# Altium schematic sheet 28_Pins.SchDoc (part 1 of 4)
size A2; SheetNumber: 1; SheetTotal: 1
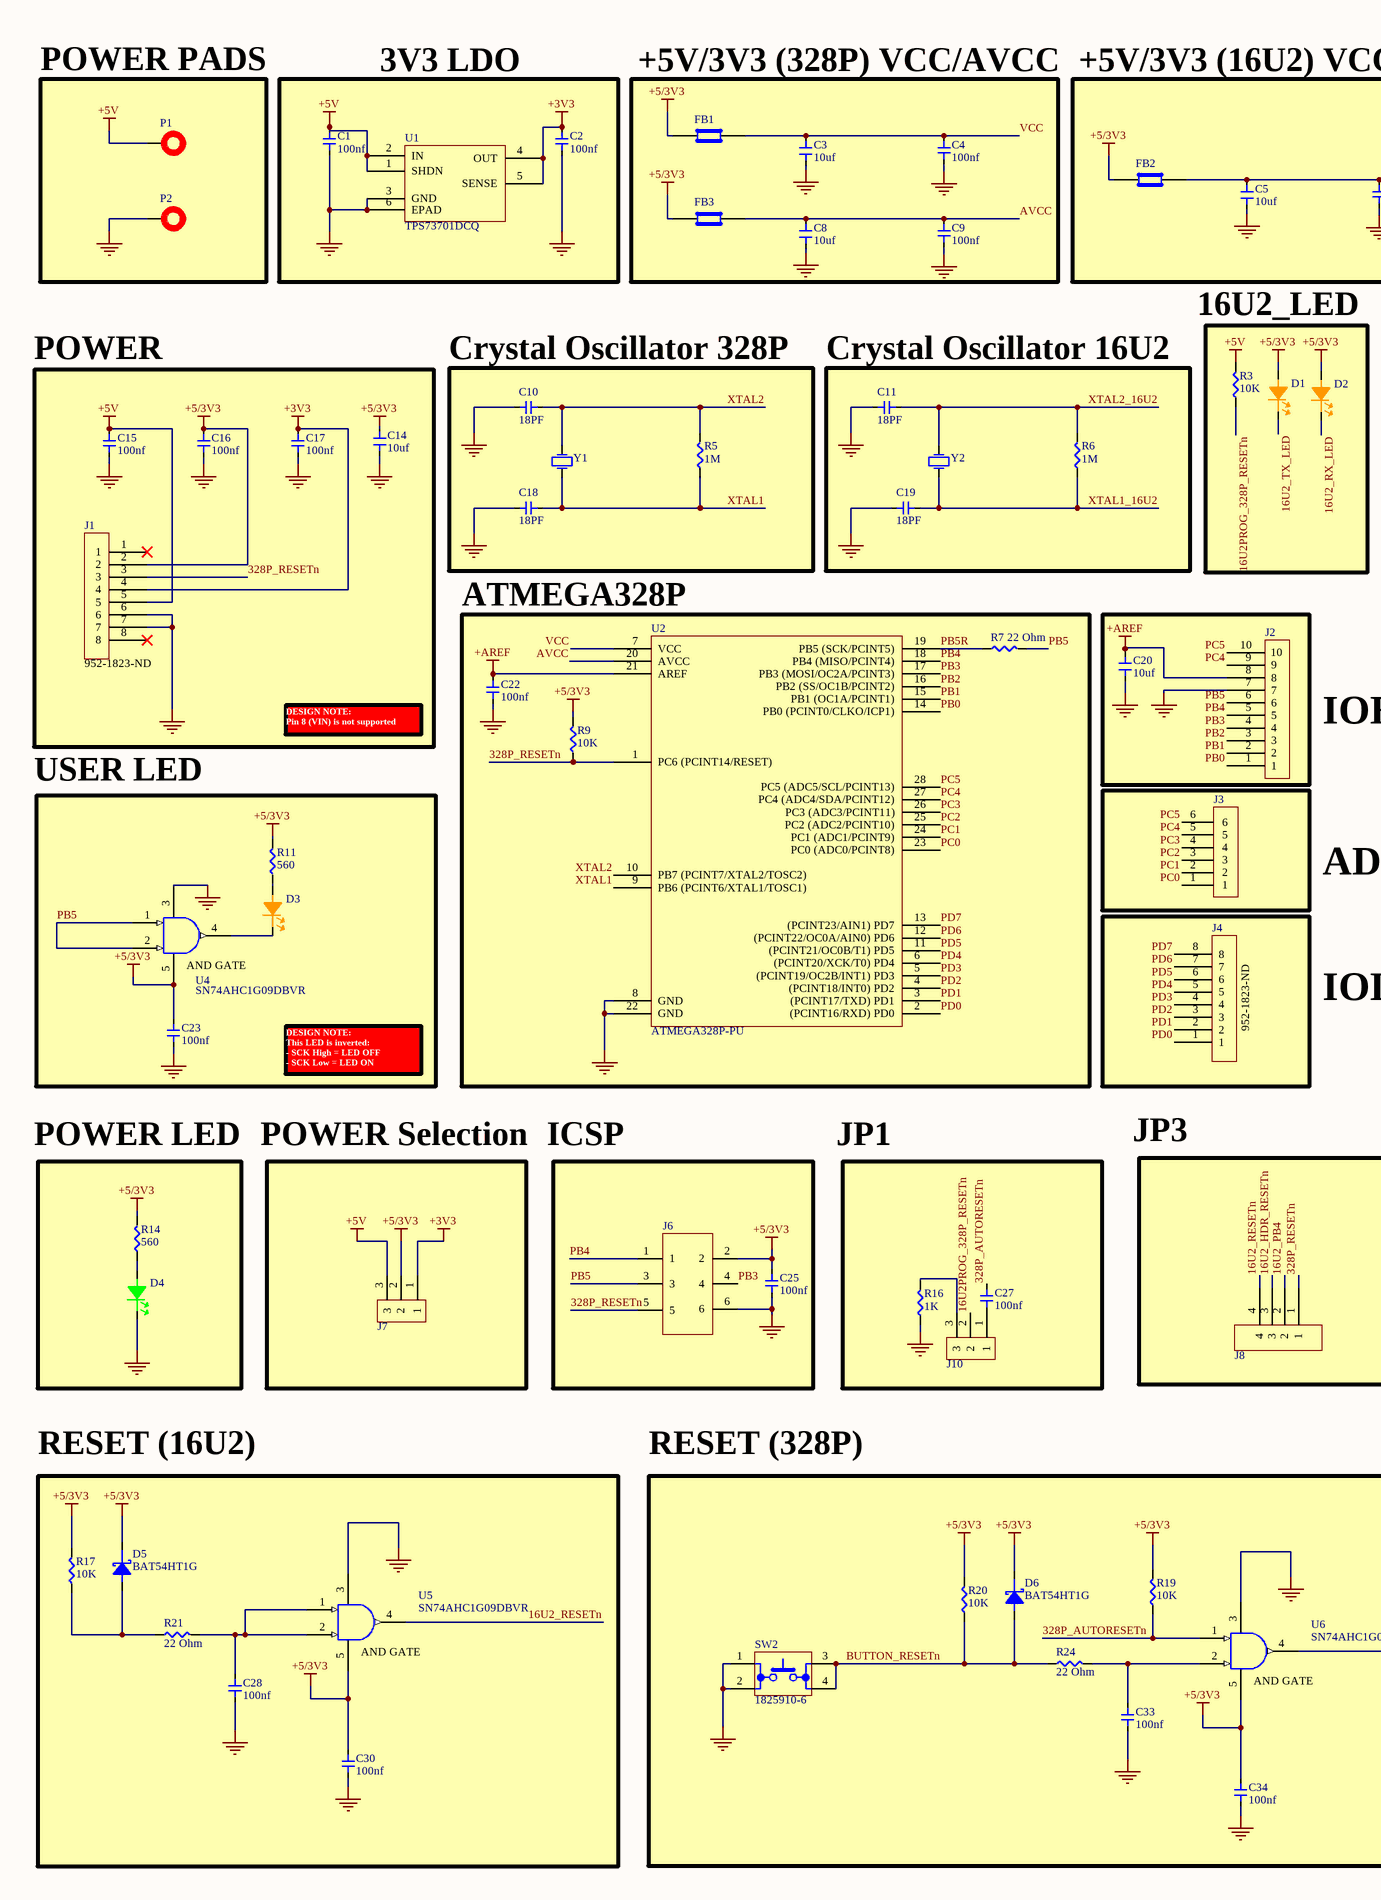
[diagram p0: 28_Pins.SchDoc, left]
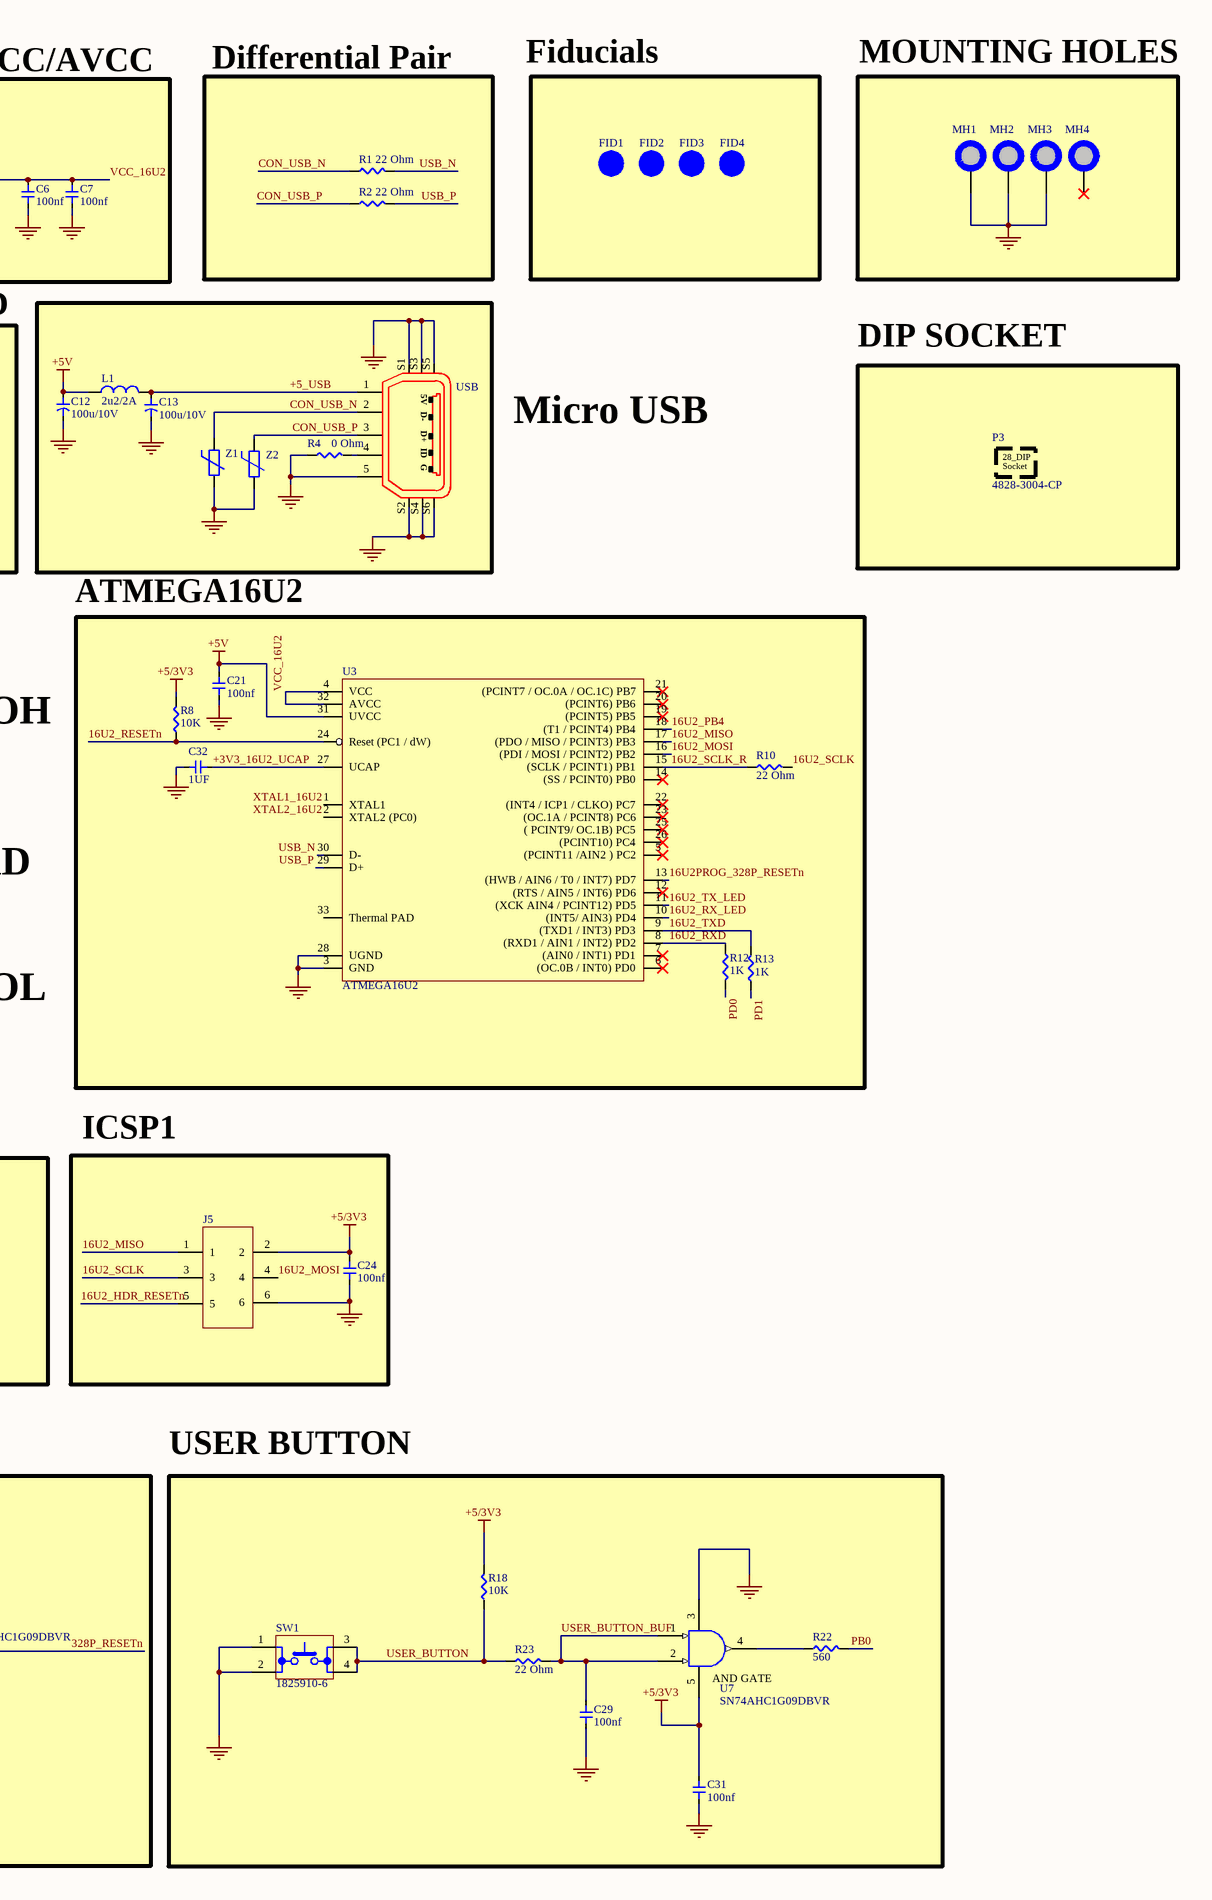
[diagram p1: 28_Pins.SchDoc, right]

## Parts
C1  100nf  [Cap_100nf]
C2  100nf  [Cap_100nf]
C3  10uf  [Cap_10uf]
C4  100nf  [Cap_100nf]
C5  10uf  [Cap_10uf]
C6  100nf  [Cap_100nf]
C7  100nf  [Cap_100nf]
C8  10uf  [Cap_10uf]
C9  100nf  [Cap_100nf]
C10  18PF  [Cap_100nf]
C11  18PF  [Cap_100nf]
C12  100u/10V  [Capacitor100uf]
C13  100u/10V  [Capacitor100uf]
C14  10uf  [Cap_10uf]
C15  100nf  [Cap_100nf]
C16  100nf  [Cap_100nf]
C17  100nf  [Cap_100nf]
C18  18PF  [Cap_100nf]
C19  18PF  [Cap_100nf]
C20  10uf  [Cap_10uf]
C21  100nf  [Cap_100nf]
C22  100nf  [Cap_100nf]
C23  100nf  [Cap_100nf]
C24  100nf  [Cap_100nf]
C25  100nf  [Cap_100nf]
C27  100nf  [Cap_100nf]
C28  100nf  [Cap_100nf]
C29  100nf  [Cap_100nf]
C30  100nf  [Cap_100nf]
C31  100nf  [Cap_100nf]
C32  1UF  [Cap_10uf]
C33  100nf  [Cap_100nf]
C34  100nf  [Cap_100nf]
D1  LO L29K-H2K1-24-0-2-R18-Z  [LED Indication]  (value not drawn)
D2  LO L29K-H2K1-24-0-2-R18-Z  [LED Indication]  (value not drawn)
D3  LO L29K-H2K1-24-0-2-R18-Z  [LED Indication]  (value not drawn)
D4  LG L29K-G2J1-24-0-2-R18-Z  [LED Indication]  (value not drawn)
D5  BAT54HT1G  [diode]
D6  BAT54HT1G  [diode]
FB1  MPZ2012S601AT000  [Cap_10uf]  (value not drawn)
FB2  MPZ2012S601AT000  [Cap_10uf]  (value not drawn)
FB3  MPZ2012S601AT000  [Cap_10uf]  (value not drawn)
FID1  Fid_1MMC  [FID]  (value not drawn)  (no BOM)
FID2  Fid_1MMC  [FID]  (value not drawn)  (no BOM)
FID3  Fid_1MMC  [FID]  (value not drawn)  (no BOM)
FID4  Fid_1MMC  [FID]  (value not drawn)  (no BOM)
J1  Supplier Part Number 1: 952-1823-ND  [header_8pins]  (hidden comment: M20-7820842)
J2  M20-7821046  [female header]  (value not drawn)
J3  M20-7820646  [header_6pins]  (value not drawn)
J4  Supplier Part Number 1: 952-1823-ND  [header_8pins]  (hidden comment: M20-7820842)
J5  67997-106HLF  [header_6pins]  (value not drawn)
J6  67997-106HLF  [header_6pins]  (value not drawn)
J7  68000-103HLF  [header_3pins]  (value not drawn)
J8  68001-204HLF  [header_4pins]  (value not drawn)
J10  68000-103HLF  [header_3pins]  (value not drawn)
L1  2u2/2A  [inductor]
MH1  Mounting Holes  [MH]  (value not drawn)  (no BOM)
MH2  Mounting Holes  [MH]  (value not drawn)  (no BOM)
MH3  Mounting Holes  [MH]  (value not drawn)  (no BOM)
MH4  Mounting Holes  [MH]  (value not drawn)  (no BOM)
P1  pad  [MH]  (value not drawn)
P2  pad  [MH]  (value not drawn)
P3  4828-3004-CP  [dip_socket]
R1  22 Ohm  [Resistor_1M]
R2  22 Ohm  [Resistor_1M]
R3  10K  [Resistor_1M]
R4  0 Ohm  [Resistor_1M]
R5  1M  [Resistor_1M]
R6  1M  [Resistor_1M]
R7  22 Ohm  [Resistor_1M]
R8  10K  [Resistor_1M]
R9  10K  [Resistor_1M]
R10  22 Ohm  [Resistor_1M]
R11  560  [Resistor_1M]
R12  1K  [Resistor_1M]
R13  1K  [Resistor_1M]
R14  560  [Resistor_1M]
R16  1K  [Resistor_1M]
R17  10K  [Resistor_1M]
R18  10K  [Resistor_1M]
R19  10K  [Resistor_1M]
R20  10K  [Resistor_1M]
R21  22 Ohm  [Resistor_1M]
R22  560  [Resistor_1M]
R23  22 Ohm  [Resistor_1M]
R24  22 Ohm  [Resistor_1M]
SW1  1825910-6  [Switch]
SW2  1825910-6  [Switch]
U1  TPS73701DCQ  [LDO]
U2  ATMEGA328P-PU  [DIP28]
U3  ATMEGA16U2  [ATMEGA16U2]
U4  SN74AHC1G09DBVR  [AND]
U5  SN74AHC1G09DBVR  [AND]
U6  SN74AHC1G09DBVR  [AND]
U7  SN74AHC1G09DBVR  [AND]
USB  10118193-0001LF  [AMPHENOL_10118193-0001LF]  (value not drawn)
Y1  ABM7-16.000MHZ-D2Y-T  [crystal]  (value not drawn)
Y2  ABM7-16.000MHZ-D2Y-T  [crystal]  (value not drawn)
Z1  CG0603MLC-05E  [varistor]  (value not drawn)
Z2  CG0603MLC-05E  [varistor]  (value not drawn)

## Blocks framed on the sheet
POWER PADS: P1 P2
3V3 LDO: C1 C2 U1
+5V/3V3 (328P) VCC/AVCC: C3 C4 C8 C9 FB1 FB3
+5V/3V3 (16U2) VCC/AVCC: C5-C7 FB2
Differential Pair: R1 R2
MOUNTING HOLES: MH1-MH4
POWER: C14-C17 J1
Crystal Oscillator 328P: C10 C18 R5 Y1
Crystal Oscillator 16U2: C11 C19 R6 Y2
DIP SOCKET: P3
ATMEGA328P: C22 R7 R9 U2
ATMEGA16U2: C21 C32 R8 R10 R12 R13 U3
USER LED: C23 D3 R11 U4
ICSP1: C24 J5
RESET (16U2): C28 C30 D5 R17 R21 U5
RESET (328P): C33 C34 D6 R19 R20 R24 SW2 U6
USER BUTTON: C29 C31 R18 R22 R23 SW1 U7

## Nets
+3V3: C2.2 C17.2 J1.4 J7.1 U1.4(OUT) U1.5(SENSE)
+5/3V3: C14.1 C16.2 C23.2 C24.2 C25.2 C30.2 C31.2 C34.2 D1.2(anode) D2.2(anode) D5.1(cathode) D6.1(cathode) FB1.1 FB2.1 FB3.1 J1.2 J5.2 J6.2 J7.2 R8.2 R9.2 R11.2 R14.2 R17.2 R18.2 R19.2 R20.2 U4.5 U5.5 U6.5 U7.5
+5V: C1.2 C12.1(+) C15.2 C21.2 J1.5 J7.3 L1.14 P1.1 R3.2 U1.1(SHDN) U1.2(IN) U3.31(UVCC)
+AREF: C20.1 C22.2 J2.8 U2.21(AREF)
GND: C1.1 C2.1 C3.2 C4.1 C5.2 C6.1 C7.1 C8.2 C9.1 C10.2 C11.2 C12.2 C13.2 C14.2 C15.1 C16.1 C17.1 C18.2 C19.2 C20.2 C21.1 C22.1 C23.1 C24.1 C25.1 C28.2 C29.2 C30.1 C31.1 C32.2 C33.2 C34.1 D4.1(cathode) J1.6 J1.7 J2.7 J5.6 J6.6 MH1.1 MH2.1 MH3.1 P2.1 R4.1 R16.1 SW1.1 SW1.2 SW2.1 SW2.2 U1.3(GND) U1.6(EPAD) U2.8(GND) U2.22(GND) U3.3(GND) U3.28(UGND) U4.3 U5.3 U6.3 U7.3 USB.5 USB.S1 USB.S2 USB.S3 USB.S4 USB.S5 USB.S6 Z1.12 Z2.12
16U2_HDR_RESETn: J5.5 J8.3
16U2_MISO: J5.1 U3.17((PDO_/_MISO_/_PCINT3)_PB3)
16U2_MOSI: J5.4 U3.16((PDI_/_MOSI_/_PCINT2)_PB2)
16U2_PB4: J8.2 U3.18((T1_/_PCINT4)_PB4)
16U2_RESETn: J8.4 R8.1 U3.24(Reset_(PC1_/_dW)) U5.4
16U2_RX_LED: D2.1(cathode) U3.10((INT5/_AIN3)_PD4)
16U2_RXD: R12.1 U3.8((RXD1_/_AIN1_/_INT2)_PD2)
16U2_SCLK: J5.3 R10.2
16U2_SCLK_R: R10.1 U3.15((SCLK_/_PCINT1)_PB1)
16U2_TX_LED: D1.1(cathode) U3.11((XCK_AIN4_/_PCINT12)_PD5)
16U2_TXD: R13.2 U3.9((TXD1_/_INT3)_PD3)
16U2PROG_328P_RESETn: J10.2 R3.1 U3.13((HWB_/_AIN6_/_T0_/_INT7)_PD7)
328P_AUTORESETn: C27.2 R19.1 U6.1
328P_RESETn: J1.3 J6.5 J8.1 R9.1 U2.1(PC6_(PCINT14/RESET)) U6.4
+3V3_16U2_UCAP: C32.1 U3.27(UCAP)
+5_USB: C13.1(+) L1.15 USB.1
AVCC: C8.1 C9.2 FB3.2 U2.20(AVCC)
BUTTON_RESETn: D6.2(anode) R20.1 R24.1 SW2.3 SW2.4
CON_USB_N: R1.1 USB.2 Z1.13
CON_USB_P: R2.1 USB.3 Z2.13
PB0: J2.1 R22.2 U2.14(PB0_(PCINT0/CLKO/ICP1))
PB1: J2.2 U2.15(PB1_(OC1A/PCINT1))
PB2: J2.3 U2.16(PB2_(SS/OC1B/PCINT2))
PB3: J2.4 J6.4 U2.17(PB3_(MOSI/OC2A/PCINT3))
PB4: J2.5 J6.1 U2.18(PB4_(MISO/PCINT4))
PB5: J2.6 J6.3 R7.2 U4.1 U4.2
PB5R: R7.1 U2.19(PB5_(SCK/PCINT5))
PC0: J3.1 U2.23(PC0_(ADC0/PCINT8))
PC1: J3.2 U2.24(PC1_(ADC1/PCINT9))
PC2: J3.3 U2.25(PC2_(ADC2/PCINT10))
PC3: J3.4 U2.26(PC3_(ADC3/PCINT11))
PC4: J2.9 J3.5 U2.27(PC4_(ADC4/SDA/PCINT12))
PC5: J2.10 J3.6 U2.28(PC5_(ADC5/SCL/PCINT13))
PD0: J4.1 R12.2 U2.2((PCINT16/RXD)_PD0)
PD1: J4.2 R13.1 U2.3((PCINT17/TXD)_PD1)
PD2: J4.3 U2.4((PCINT18/INT0)_PD2)
PD3: J4.4 U2.5((PCINT19/OC2B/INT1)_PD3)
PD4: J4.5 U2.6((PCINT20/XCK/T0)_PD4)
PD5: J4.6 U2.11((PCINT21/OC0B/T1)_PD5)
PD6: J4.7 U2.12((PCINT22/OC0A/AIN0)_PD6)
PD7: J4.8 U2.13((PCINT23/AIN1)_PD7)
USB_N: R1.2 U3.30(D-)
USB_P: R2.2 U3.29(D+)
USER_BUTTON: R18.1 R23.1 SW1.3 SW1.4
USER_BUTTON_BUF: C29.1 R23.2 U7.1 U7.2
VCC: C3.1 C4.2 FB1.2 U2.7(VCC)
VCC_16U2: C5.1 C6.2 C7.2 FB2.2 U3.4(VCC) U3.32(AVCC)
XTAL1: C18.1 R5.1 U2.9(PB6_(PCINT6/XTAL1/TOSC1)) Y1.1
XTAL1_16U2: C19.1 R6.1 U3.1(XTAL1) Y2.1
XTAL2: C10.1 R5.2 U2.10(PB7_(PCINT7/XTAL2/TOSC2)) Y1.2
XTAL2_16U2: C11.1 R6.2 U3.2(XTAL2_(PC0)) Y2.2
NetC27_1: C27.1 J10.1
NetC28_1: C28.1 R21.2 U5.1 U5.2
NetC33_1: C33.1 R24.2 U6.2
NetD3_1: D3.1(cathode) U4.4
NetD3_2: D3.2(anode) R11.1
NetD4_2: D4.2(anode) R14.1
NetD5_2: D5.2(anode) R17.1 R21.1
NetJ10_3: J10.3 R16.2
NetR4_2: R4.2 USB.4
NetR22_1: R22.1 U7.4

Not connected (* = marked no-connect by the designer): J1 1* 8*; MH4 1*; U3 5((PCINT11_/AIN2_)_PC2)* 6((OC.0B_/_INT0)_PD0)* 7((AIN0_/_INT1)_PD1)* 12((RTS_/_AIN5_/_INT6)_PD6)* 14((SS_/_PCINT0)_PB0)* 19((PCINT5)_PB5)* 20(_(PCINT6)_PB6)* 21((PCINT7_/_OC.0A_/_OC.1C)_PB7)* 22((INT4_/_ICP1_/_CLKO)_PC7)* 23((OC.1A_/_PCINT8)_PC6)* 25((_PCINT9/_OC.1B)_PC5)* 26((PCINT10)_PC4)* 33(Thermal_PAD)

## Notes on the sheet
- Fiducials
- 16U2_LED
- Micro USB
- DESIGN NOTE:
  Pin 8 (VIN) is not supported
- IOH
- AD
- IOL
- DESIGN NOTE:
  This LED is inverted:
  - SCK High = LED OFF
  - SCK Low = LED ON
- POWER LED
- POWER Selection
- ICSP
- JP1
- JP3
- (in symbol 4828-3004-CP) 28_DIP; Socket
- (in symbol 10118193-0001LF) 5V; D-; D+; ID; G
- (in symbol SN74AHC1G09DBVR) AND GATE